# Altium schematic sheet linux_module.SchDoc
size A3; Organization: Develer s.r.l.; Address1: via Mugellese 1/A; Address2: 50019 Campi Bisenzio; Address3: Firenze; Address4: ITALY; Revision: A; SheetNumber: 1; SheetTotal: 1
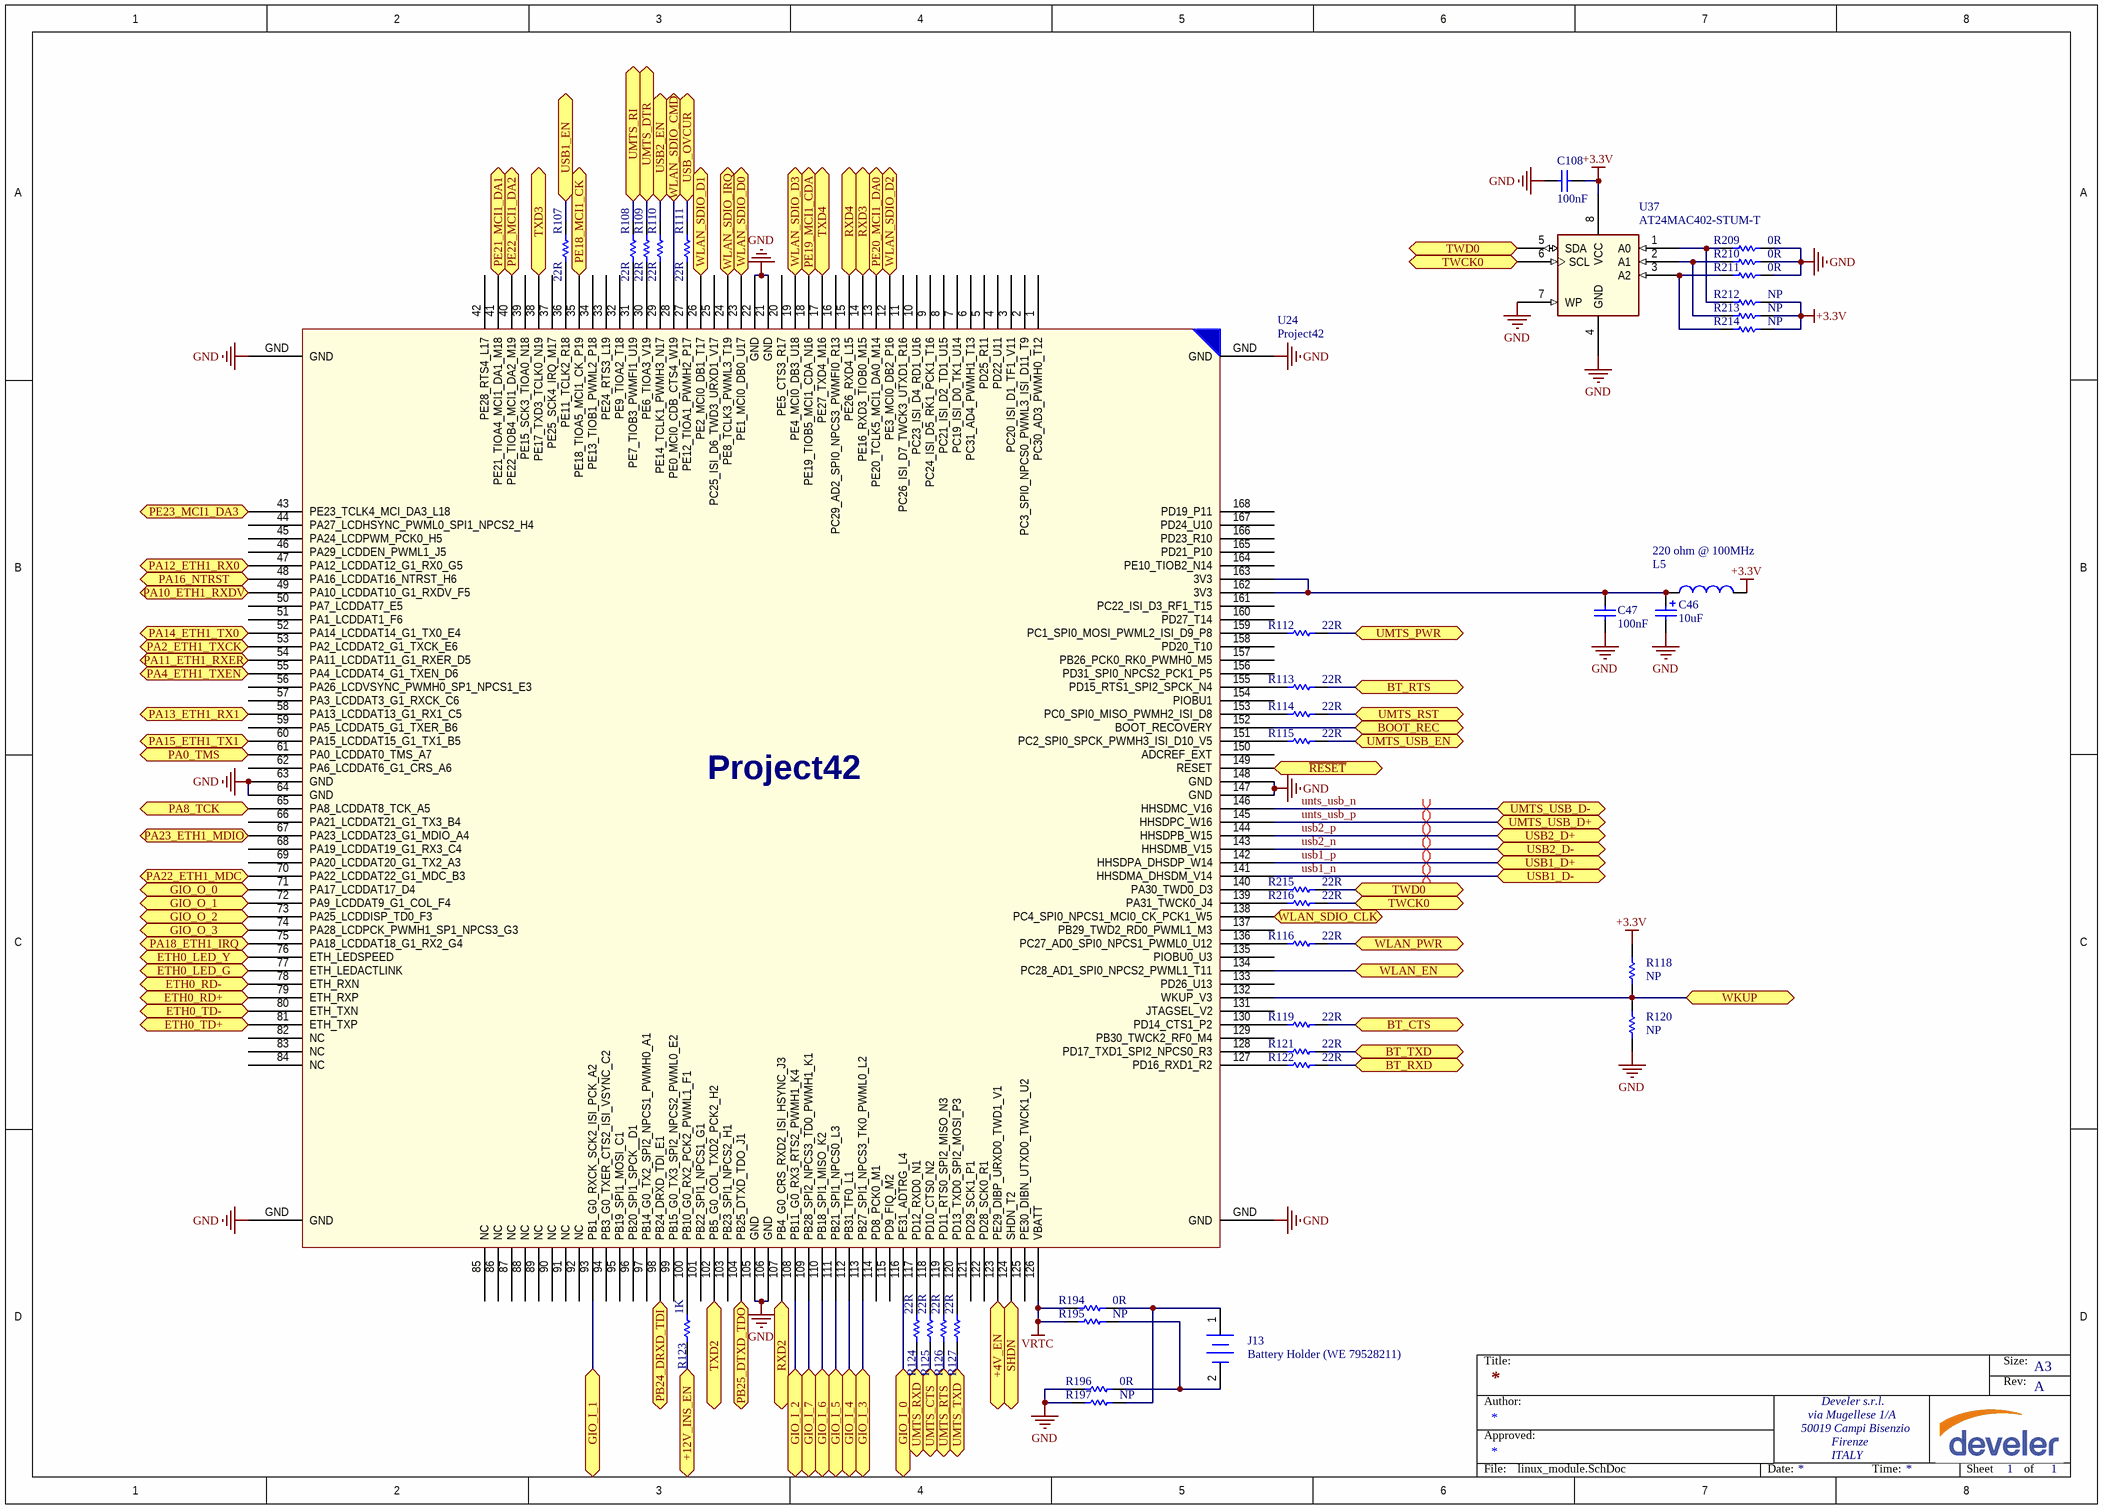
[diagram p0: linux_module.SchDoc]

## Parts
C46  10uF  [1206_[3216]]
C47  100nF  [0603_[1608]]
C108  100nF  [0603_[1608]]
J13  Battery Holder (WE 79528211)  [Battery_cr2032_holder]
L5  220 ohm @ 100MHz  [0805_[2012]]
R107  22R  [0603_[1608]]
R108  22R  [0603_[1608]]
R109  22R  [0603_[1608]]
R110  22R  [0603_[1608]]
R111  22R  [0603_[1608]]
R112  22R  [0603_[1608]]
R113  22R  [0603_[1608]]
R114  22R  [0603_[1608]]
R115  22R  [0603_[1608]]
R116  22R  [0603_[1608]]
R118  NP  [0603_[1608]]
R119  22R  [0603_[1608]]
R120  NP  [0603_[1608]]
R121  22R  [0603_[1608]]
R122  22R  [0603_[1608]]
R123  1K  [0603_[1608]]
R124  22R  [0603_[1608]]
R125  22R  [0603_[1608]]
R126  22R  [0603_[1608]]
R127  22R  [0603_[1608]]
R194  0R  [0603_[1608]]
R195  NP  [0603_[1608]]
R196  0R  [0603_[1608]]
R197  NP  [0603_[1608]]
R209  0R  [0603_[1608]]
R210  0R  [0603_[1608]]
R211  0R  [0603_[1608]]
R212  NP  [0603_[1608]]
R213  NP  [0603_[1608]]
R214  NP  [0603_[1608]]
R215  22R  [0603_[1608]]
R216  22R  [0603_[1608]]
U24  Project42  [project42_footprint]
U37  AT24MAC402-STUM-T  [SOIC8]

## Ports
+4V_EN, +12V_INS_EN, BOOT_REC, BT_CTS, BT_RTS, BT_RXD, BT_TXD, ETH0_LED_G, ETH0_LED_Y, ETH0_RD+, ETH0_RD-, ETH0_TD+, ETH0_TD-, GIO_I_0, GIO_I_1, GIO_I_2, GIO_I_3, GIO_I_4, GIO_I_5, GIO_I_6, GIO_I_7, GIO_O_0, GIO_O_1, GIO_O_2, GIO_O_3, PA0_TMS, PA2_ETH1_TXCK, PA4_ETH1_TXEN, PA8_TCK, PA10_ETH1_RXDV, PA11_ETH1_RXER, PA12_ETH1_RX0, PA13_ETH1_RX1, PA14_ETH1_TX0, PA15_ETH1_TX1, PA16_NTRST, PA18_ETH1_IRQ, PA22_ETH1_MDC, PA23_ETH1_MDIO, PB24_DRXD_TDI, PB25_DTXD_TDO, PE18_MCI1_CK, PE19_MCI1_CDA, PE20_MCI1_DA0, PE21_MCI1_DA1, PE22_MCI1_DA2, PE23_MCI1_DA3, RXD2, RXD3, RXD4, SHDN, TWCK0, TWD0, TXD2, TXD3, TXD4, UMTS_CTS, UMTS_DTR, UMTS_PWR, UMTS_RI, UMTS_RST, UMTS_RTS, UMTS_RXD, UMTS_TXD, UMTS_USB_D+, UMTS_USB_D-, UMTS_USB_EN, USB1_D+, USB1_D-, USB1_EN, USB2_D+, USB2_D-, USB2_EN, USB_OVCUR, WKUP, WLAN_EN, WLAN_PWR, WLAN_SDIO_CLK, WLAN_SDIO_CMD, WLAN_SDIO_D0, WLAN_SDIO_D1, WLAN_SDIO_D2, WLAN_SDIO_D3, WLAN_SDIO_IRQ, ~{RESET}

## Nets
+3.3V: C108.1 L5.1 R118.2 R212.1 R213.1 R214.1 U37.8(VCC)
GND: C46.2 C47.2 C108.2 R120.1 R196.2 R197.2 R209.1 R210.1 R211.1 U24.21(GND) U24.22(GND) U24.63(GND) U24.64(GND) U24.105(GND) U24.106(GND) U24.147(GND) U24.148(GND) U24.GND U37.4(GND) U37.7(WP)
VRTC: R194.2 R195.2 U24.126(VBATT)
+4V_EN: U24.123(PE29_DIBP_URXD0_TWD1_V1) ; port +4V_EN
+12V_INS_EN: R123.1 ; port +12V_INS_EN
~{RESET}: U24.149(RESET) ; port ~{RESET}
BOOT_REC: U24.152(BOOT_RECOVERY) ; port BOOT_REC
BT_CTS: R119.1 ; port BT_CTS
BT_RTS: R113.1 ; port BT_RTS
BT_RXD: R122.1 ; port BT_RXD
BT_TXD: R121.1 ; port BT_TXD
ETH0_LED_G: U24.77(ETH_LEDACTLINK) ; port ETH0_LED_G
ETH0_LED_Y: U24.76(ETH_LEDSPEED) ; port ETH0_LED_Y
ETH0_RD+: U24.79(ETH_RXP) ; port ETH0_RD+
ETH0_RD-: U24.78(ETH_RXN) ; port ETH0_RD-
ETH0_TD+: U24.81(ETH_TXP) ; port ETH0_TD+
ETH0_TD-: U24.80(ETH_TXN) ; port ETH0_TD-
GIO_I_0: U24.116(PE31_ADTRG_L4) ; port GIO_I_0
GIO_I_1: U24.93(PB1_G0_RXCK_SCK2_ISI_PCK_A2) ; port GIO_I_1
GIO_I_2: U24.108(PB11_G0_RX3_RTS2_PWMH1_K4) ; port GIO_I_2
GIO_I_3: U24.113(PB27_SPI1_NPCS3_TK0_PWML0_L2) ; port GIO_I_3
GIO_I_4: U24.112(PB31_TF0_L1) ; port GIO_I_4
GIO_I_5: U24.111(PB21_SPI1_NPCS0_L3) ; port GIO_I_5
GIO_I_6: U24.110(PB18_SPI1_MISO_K2) ; port GIO_I_6
GIO_I_7: U24.109(PB28_SPI2_NPCS3_TD0_PWMH1_K1) ; port GIO_I_7
GIO_O_0: U24.71(PA17_LCDDAT17_D4) ; port GIO_O_0
GIO_O_1: U24.72(PA9_LCDDAT9_G1_COL_F4) ; port GIO_O_1
GIO_O_2: U24.73(PA25_LCDDISP_TD0_F3) ; port GIO_O_2
GIO_O_3: U24.74(PA28_LCDPCK_PWMH1_SP1_NPCS3_G3) ; port GIO_O_3
PA0_TMS: U24.61(PA0_LCDDAT0_TMS_A7) ; port PA0_TMS
PA2_ETH1_TXCK: U24.53(PA2_LCDDAT2_G1_TXCK_E6) ; port PA2_ETH1_TXCK
PA4_ETH1_TXEN: U24.55(PA4_LCDDAT4_G1_TXEN_D6) ; port PA4_ETH1_TXEN
PA8_TCK: U24.65(PA8_LCDDAT8_TCK_A5) ; port PA8_TCK
PA10_ETH1_RXDV: U24.49(PA10_LCDDAT10_G1_RXDV_F5) ; port PA10_ETH1_RXDV
PA11_ETH1_RXER: U24.54(PA11_LCDDAT11_G1_RXER_D5) ; port PA11_ETH1_RXER
PA12_ETH1_RX0: U24.47(PA12_LCDDAT12_G1_RX0_G5) ; port PA12_ETH1_RX0
PA13_ETH1_RX1: U24.58(PA13_LCDDAT13_G1_RX1_C5) ; port PA13_ETH1_RX1
PA14_ETH1_TX0: U24.52(PA14_LCDDAT14_G1_TX0_E4) ; port PA14_ETH1_TX0
PA15_ETH1_TX1: U24.60(PA15_LCDDAT15_G1_TX1_B5) ; port PA15_ETH1_TX1
PA16_NTRST: U24.48(PA16_LCDDAT16_NTRST_H6) ; port PA16_NTRST
PA18_ETH1_IRQ: U24.75(PA18_LCDDAT18_G1_RX2_G4) ; port PA18_ETH1_IRQ
PA22_ETH1_MDC: U24.70(PA22_LCDDAT22_G1_MDC_B3) ; port PA22_ETH1_MDC
PA23_ETH1_MDIO: U24.67(PA23_LCDDAT23_G1_MDIO_A4) ; port PA23_ETH1_MDIO
PB24_DRXD_TDI: U24.98(PB24_DRXD_TDI_E1) ; port PB24_DRXD_TDI
PB25_DTXD_TDO: U24.104(PB25_DTXD_TDO_J1) ; port PB25_DTXD_TDO
PE18_MCI1_CK: U24.35(PE18_TIOA5_MCI1_CK_P19) ; port PE18_MCI1_CK
PE19_MCI1_CDA: U24.18(PE19_TIOB5_MCI1_CDA_N16) ; port PE19_MCI1_CDA
PE20_MCI1_DA0: U24.13(PE20_TCLK5_MCI1_DA0_M14) ; port PE20_MCI1_DA0
PE21_MCI1_DA1: U24.41(PE21_TIOA4_MCI1_DA1_M18) ; port PE21_MCI1_DA1
PE22_MCI1_DA2: U24.40(PE22_TIOB4_MCI1_DA2_M19) ; port PE22_MCI1_DA2
PE23_MCI1_DA3: U24.43(PE23_TCLK4_MCI_DA3_L18) ; port PE23_MCI1_DA3
RXD2: U24.107(PB4_G0_CRS_RXD2_ISI_HSYNC_J3) ; port RXD2
RXD3: U24.14(PE16_RXD3_TIOB0_M15) ; port RXD3
RXD4: U24.15(PE26_RXD4_L15) ; port RXD4
SHDN: U24.124(SHDN_T2) ; port SHDN
TWCK0: R216.1 U37.6(SCL) ; port TWCK0
TWD0: R215.1 U37.5(SDA) ; port TWD0
TXD2: U24.102(PB5_G0_COL_TXD2_PCK2_H2) ; port TXD2
TXD3: U24.38(PE17_TXD3_TCLK0_N19) ; port TXD3
TXD4: U24.17(PE27_TXD4_M16) ; port TXD4
UMTS_CTS: R125.1 ; port UMTS_CTS
UMTS_DTR: R109.1 ; port UMTS_DTR
UMTS_PWR: R112.1 ; port UMTS_PWR
UMTS_RI: R108.1 ; port UMTS_RI
UMTS_RST: R114.1 ; port UMTS_RST
UMTS_RTS: R126.1 ; port UMTS_RTS
UMTS_RXD: R124.1 ; port UMTS_RXD
UMTS_TXD: R127.1 ; port UMTS_TXD
UMTS_USB_EN: R115.1 ; port UMTS_USB_EN
unts_usb_n: U24.146(HHSDMC_V16) ; port UMTS_USB_D-
unts_usb_p: U24.145(HHSDPC_W16) ; port UMTS_USB_D+
USB1_EN: R107.1 ; port USB1_EN
usb1_n: U24.141(HHSDMA_DHSDM_V14) ; port USB1_D-
usb1_p: U24.142(HHSDPA_DHSDP_W14) ; port USB1_D+
USB2_EN: R110.1 ; port USB2_EN
usb2_n: U24.143(HHSDMB_V15) ; port USB2_D-
usb2_p: U24.144(HHSDPB_W15) ; port USB2_D+
USB_OVCUR: R111.1 ; port USB_OVCUR
WKUP: R118.1 R120.2 U24.132(WKUP_V3) ; port WKUP
WLAN_EN: U24.134(PC28_AD1_SPI0_NPCS2_PWML1_T11) ; port WLAN_EN
WLAN_PWR: R116.1 ; port WLAN_PWR
WLAN_SDIO_CLK: U24.138(PC4_SPI0_NPCS1_MCI0_CK_PCK1_W5) ; port WLAN_SDIO_CLK
WLAN_SDIO_CMD: U24.28(PE0_MCI0_CDB_CTS4_W19) ; port WLAN_SDIO_CMD
WLAN_SDIO_D0: U24.23(PE1_MCI0_DB0_U17) ; port WLAN_SDIO_D0
WLAN_SDIO_D1: U24.26(PE2_MCI0_DB1_T17) ; port WLAN_SDIO_D1
WLAN_SDIO_D2: U24.12(PE3_MCI0_DB2_P16) ; port WLAN_SDIO_D2
WLAN_SDIO_D3: U24.19(PE4_MCI0_DB3_U18) ; port WLAN_SDIO_D3
WLAN_SDIO_IRQ: U24.24(PE8_TCLK3_PWML3_T19) ; port WLAN_SDIO_IRQ
NetC46_1: C46.1 C47.1 L5.2 U24.162(3V3) U24.163(3V3)
NetJ13_1: J13.1(+) R194.1 R197.1
NetJ13_2: J13.2(-) R195.1 R196.1
NetR107_2: R107.2 U24.36(PE11_TCLK2_R18)
NetR108_2: R108.2 U24.31(PE7_TIOB3_PWMFI1_U19)
NetR109_2: R109.2 U24.30(PE6_TIOA3_V19)
NetR110_2: R110.2 U24.29(PE14_TCLK1_PWMH3_N17)
NetR111_2: R111.2 U24.27(PE12_TIOA1_PWMH2_P17)
NetR112_2: R112.2 U24.159(PC1_SPI0_MOSI_PWML2_ISI_D9_P8)
NetR113_2: R113.2 U24.155(PD15_RTS1_SPI2_SPCK_N4)
NetR114_2: R114.2 U24.153(PC0_SPI0_MISO_PWMH2_ISI_D8)
NetR115_2: R115.2 U24.151(PC2_SPI0_SPCK_PWMH3_ISI_D10_V5)
NetR116_2: R116.2 U24.136(PC27_AD0_SPI0_NPCS1_PWML0_U12)
NetR119_2: R119.2 U24.130(PD14_CTS1_P2)
NetR121_2: R121.2 U24.128(PD17_TXD1_SPI2_NPCS0_R3)
NetR122_2: R122.2 U24.127(PD16_RXD1_R2)
NetR123_2: R123.2 U24.100(PB10_G0_RX2_PCK2_PWML1_F1)
NetR124_2: R124.2 U24.117(PD12_RXD0_N1)
NetR125_2: R125.2 U24.118(PD10_CTS0_N2)
NetR126_2: R126.2 U24.119(PD11_RTS0_SPI2_MISO_N3)
NetR127_2: R127.2 U24.120(PD13_TXD0_SPI2_MOSI_P3)
NetR209_2: R209.2 R212.2 U37.1(A0)
NetR210_2: R210.2 R213.2 U37.2(A1)
NetR211_2: R211.2 R214.2 U37.3(A2)
NetR215_2: R215.2 U24.140(PA30_TWD0_D3)
NetR216_2: R216.2 U24.139(PA31_TWCK0_J4)

Not connected (* = marked no-connect by the designer): U24 1(PC30_AD3_PWMH0_T12) 2(PC3_SPI0_NPCS0_PWML3_ISI_D11_T9) 3(PC20_ISI_D1_TF1_V11) 4(PD22_U11) 5(PD25_R11) 6(PC31_AD4_PWMH1_T13) 7(PC19_ISI_D0_TK1_U14) 8(PC21_ISI_D2_TD1_U15) 9(PC24_ISI_D5_RK1_PCK1_T16) 10(PC23_ISI_D4_RD1_U16) 11(PC26_ISI_D7_TWCK3_UTXD1_R16) 16(PC29_AD2_SPI0_NPCS3_PWMFI0_R13) 20(PE5_CTS3_R17) 25(PC25_ISI_D6_TWD3_URXD1_V17) 32(PE9_TIOA2_T18) 33(PE24_RTS3_L19) 34(PE13_TIOB1_PWML2_P18) 37(PE25_SCK4_IRQ_M17) 39(PE15_SCK3_TIOA0_N18) 42(PE28_RTS4_L17) 44(PA27_LCDHSYNC_PWML0_SPI1_NPCS2_H4) 45(PA24_LCDPWM_PCK0_H5) 46(PA29_LCDDEN_PWML1_J5) 50(PA7_LCDDAT7_E5) 51(PA1_LCDDAT1_F6) 56(PA26_LCDVSYNC_PWMH0_SP1_NPCS1_E3) 57(PA3_LCDDAT3_G1_RXCK_C6) 59(PA5_LCDDAT5_G1_TXER_B6) 62(PA6_LCDDAT6_G1_CRS_A6) 66(PA21_LCDDAT21_G1_TX3_B4) 68(PA19_LCDDAT19_G1_RX3_C4) 69(PA20_LCDDAT20_G1_TX2_A3) 82(NC) 83(NC) 84(NC) 85(NC) 86(NC) 87(NC) 88(NC) 89(NC) 90(NC) 91(NC) 92(NC) 94(PB3_G0_TXER_CTS2_ISI_VSYNC_C2) 95(PB19_SPI1_MOSI_C1) 96(PB20_SPI1_SPCK__D1) 97(PB14_G0_TX2_SPI2_NPCS1_PWMH0_A1) 99(PB15_G0_TX3_SPI2_NPCS2_PWML0_E2) 101(PB22_SPI1_NPCS1_G1) 103(PB23_SPI1_NPCS2_H1) 114(PD8_PCK0_M1) 115(PD9_FIQ_M2) 121(PD29_SCK1_P1) 122(PD28_SCK0_R1) 125(PE30_DIBN_UTXD0_TWCK1_U2) 129(PB30_TWCK2_RF0_M4) 131(JTAGSEL_V2) 133(PD26_U13) 135(PIOBU0_U3) 137(PB29_TWD2_RD0_PWML1_M3) 150(ADCREF_EXT) 154(PIOBU1) 156(PD31_SPI0_NPCS2_PCK1_P5) 157(PB26_PCK0_RK0_PWMH0_M5) 158(PD20_T10) 160(PD27_T14) 161(PC22_ISI_D3_RF1_T15) 164(PE10_TIOB2_N14) 165(PD21_P10) 166(PD23_R10) 167(PD24_U10) 168(PD19_P11)

## Layout directives
differential pair: unts_usb_n, unts_usb_p, usb1_n, usb1_p, usb2_n, usb2_p

## Notes on the sheet
- Title:
- Size:
- Rev:
- A3
- Author:
- Approved:
- File:
- Date:
- Time:
- Sheet
- of

## Library data of the parts
C46 = Cap Pol1: Ceramic X5R 25V; Published: 8-Jun-2000; Revision: July-2002: Re-released for DXP Platform.; Publisher: Altium Limited; Value: 10uF
C47 C108 = Cap: Ceramic X7R 50V; Value: 100pF; Published: 8-Jun-2000; LatestRevisionDate: 17-Jul-2002; LatestRevisionNote: Re-released for DXP Platform.; PackageReference: RAD-0.3; Publisher: Altium Limited; PackageDescription: Radial Cap, Thru-Hole; 2 Leads; 0.3 in Pin Spacing
J13 = Battery: Multicell Battery CR2032; Published: 24-Mar-1999; LatestRevisionDate: 17-Jul-2002; LatestRevisionNote: Re-released for DXP Platform.; PackageReference: BAT-2; Publisher: Altium Limited; PackageDescription: Battery; 2 Leads
L5 = Inductor: WE 742792022
R107-R116 R118-R122 R124-R127 R194-R197 R209-R216 = Res1: Resistor; Value: 1K; Published: 8-Jun-2000; Revision: July-2002: Re-released for DXP Platform.; Publisher: Altium Limited
R123 = Res1: Resistor; Published: 8-Jun-2000; Revision: July-2002: Re-released for DXP Platform.; Publisher: Altium Limited; Value: 1K
U24 = project42_pinout: Faster Little Linux Module
U37 = EEPROM-SOIC8: EEPROM MAC 48bit EUI + Serial (AT24MAC602-STUM-T for 64bit EUI)